# EAGLE design 172x320 Screen (EAGLE 9.6.2)
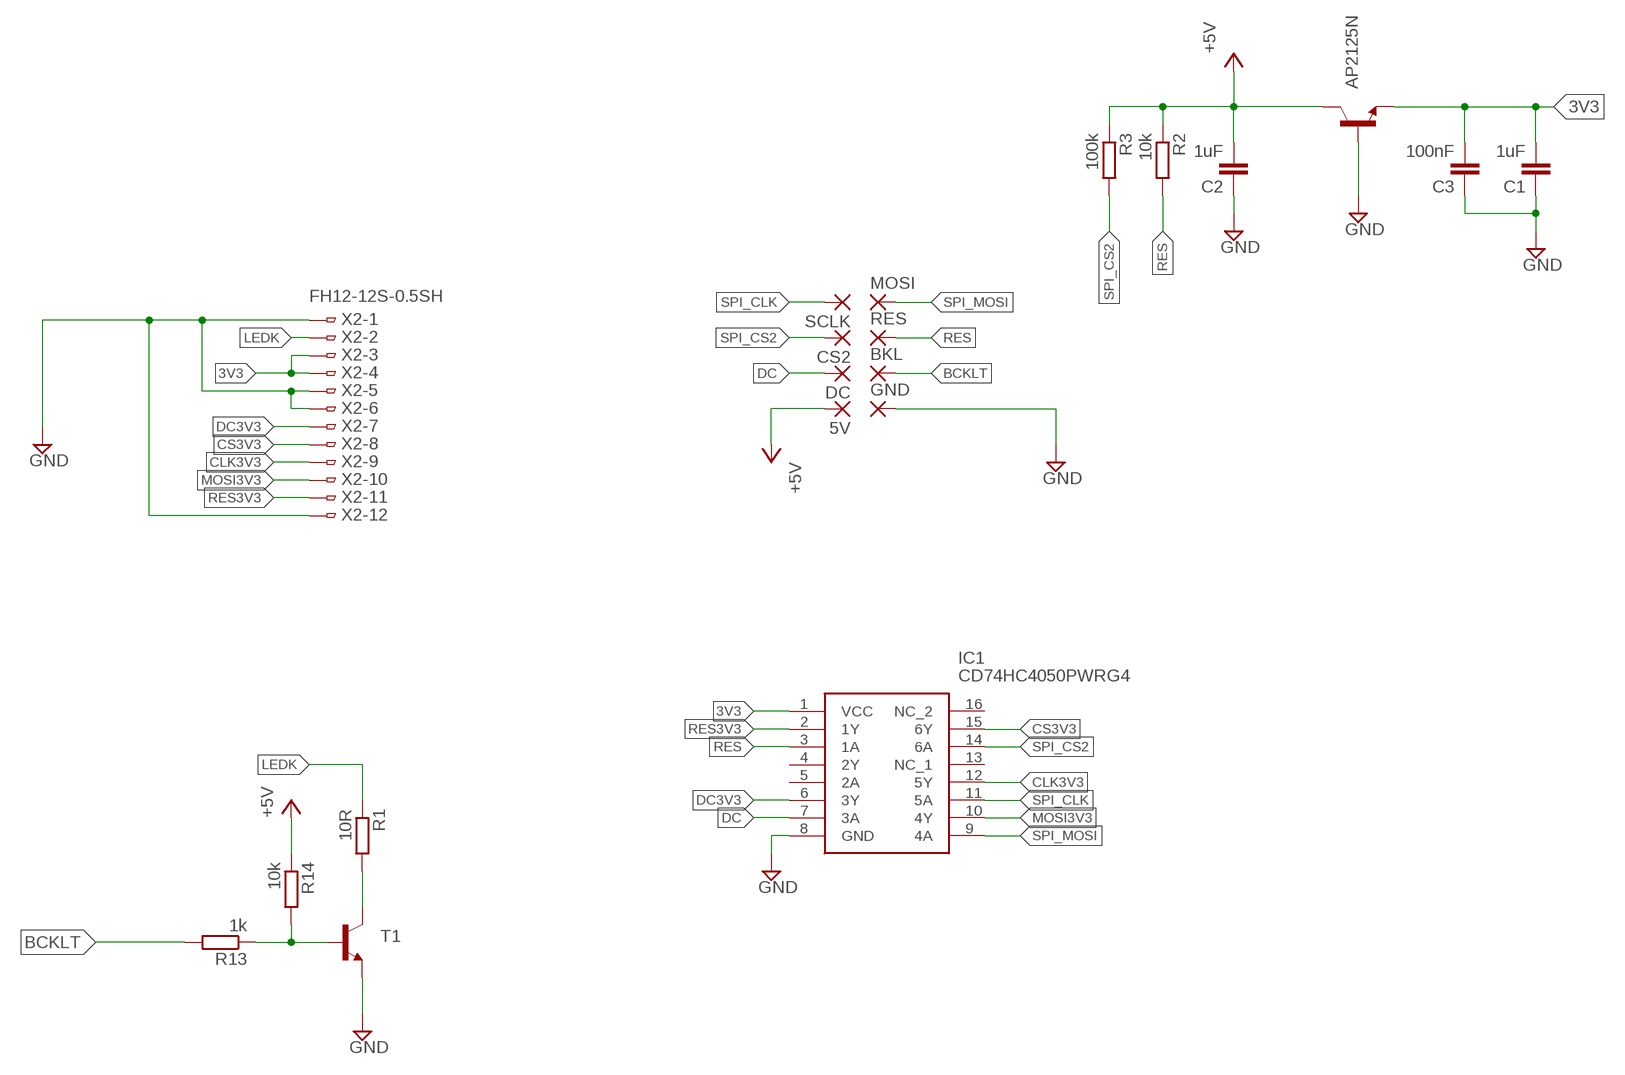
[diagram p0: schematic, sheet 1]

## Parts
5V  1,6/0,9  [1,6/0,9]
AP2125N  BC817-16-NPN-SOT23-BEC  [SOT23-BEC]
BKL  1,6/0,9  [1,6/0,9]
C1  1uF  C-EUC0805  [C0805]
C2  1uF  C-EUC0805  [C0805]
C3  100nF  C-EUC0805  [C0805]
CS2  1,6/0,9  [1,6/0,9]
DC  1,6/0,9  [1,6/0,9]
GND  1,6/0,9  [1,6/0,9]
IC1  CD74HC4050PWRG4  [SOP65P640X120-16N]
MOSI  1,6/0,9  [1,6/0,9]
R1  10R  R-EU_R0805  [R0805]
R2  10k  R-EU_R0805  [R0805]
R3  100k  R-EU_R0805  [R0805]
R13  1k  R-EU_R0805  [R0805]
R14  10k  R-EU_R0805  [R0805]
RES  1,6/0,9  [1,6/0,9]
SCLK  1,6/0,9  [1,6/0,9]
T1  BC817-16-NPN-SOT23-BEC  [SOT23-BEC]
X2  FH12-12S-0.5SH  [FH12-12S-0.5SH]

## Nets
3V3: AP2125N.E C1.2 C3.2 IC1.1(VCC) X2.3 X2.4
+5V: 5V.1(P) AP2125N.C C2.2 R2.1 R3.1 R14.1
BCKLT: BKL.1(P) R13.2
CLK3V3: IC1.12(5Y) X2.9
CS3V3: IC1.15(6Y) X2.8
DC: DC.1(P) IC1.7(3A)
DC3V3: IC1.6(3Y) X2.7
GND: AP2125N.B C1.1 C2.1 C3.1 GND.1(P) IC1.8(GND) T1.E X2.1 X2.5 X2.6 X2.12
LEDK: R1.1 X2.2
MOSI3V3: IC1.10(4Y) X2.10
N$1: R1.2 T1.C
N$16: R13.1 R14.2 T1.B
RES: IC1.3(1A) R2.2 RES.1(P)
RES3V3: IC1.2(1Y) X2.11
SPI_CLK: IC1.11(5A) SCLK.1(P)
SPI_CS2: CS2.1(P) IC1.14(6A) R3.2
SPI_MOSI: IC1.9(4A) MOSI.1(P)
Unconnected: IC1.4(2Y) IC1.5(2A) IC1.13(NC_1) IC1.16(NC_2)

## Library data of the parts
5V BKL CS2 DC GND MOSI RES SCLK = wirepad:1,6/0,9: THROUGH-HOLE PAD
AP2125N T1 = transistor:*-NPN-: NPN Transistror BF959 corrected 2008.03.06
C1-C3 = rcl:C-EU: CAPACITOR, European symbol; SPICEPREFIX: C
IC1 = CD74HC4050PWRG4:CD74HC4050PWRG4: Buffer/Converter 6-CH Non-Inverting CMOS 16-Pin TSSOP T/R Source: Datasheet <https://datasheet.datasheetarchive.com/originals/distributors/Datasheets-SFU2/DSASFU100028959.pdf>; DESCRIPTION: Buffer/Converter 6-CH Non-Inverting CMOS 16-Pin TSSOP T/R; HEIGHT: 1.2mm; MANUFACTURER_NAME: Texas Instruments; MANUFACTURER_PART_NUMBER: CD74HC4050PWRG4; MOUSER_PART_NUMBER: 595-CD74HC4050PWRG4; MOUSER_PRICE-STOCK: https://www.mouser.co.uk/ProductDetail/Texas-Instruments/CD74HC4050PWRG4?qs=xFfolx0DHx2sDiVseCJ27Q%3D%3D
R1-R3 R13 R14 = rcl:R-EU_: RESISTOR, European symbol; SPICEPREFIX: R
X2 = con-hirose-0712:FH12-12S-0.5S: 0.5mm Pitch Connectors For FPC/FFC Source: Data sheet <http://www.hirose.co.jp/cataloge_hp/e58605370.pdf>; MPN: FH12-12S-0.5SH(55); OC_FARNELL: 1324542; OC_NEWARK: 34M6155

## Board
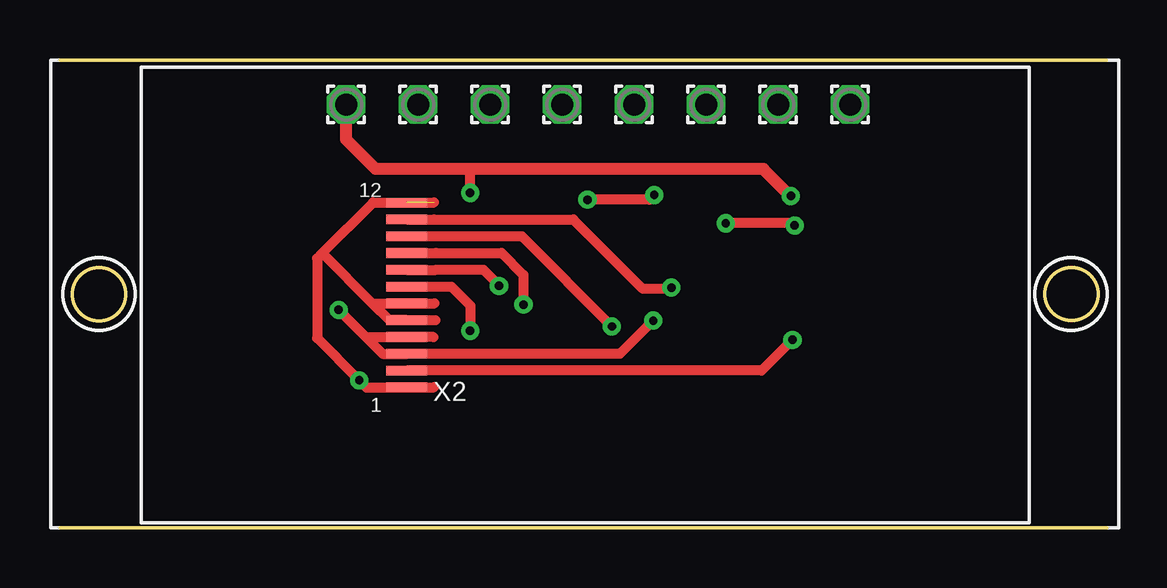
[diagram p1: board, top side]
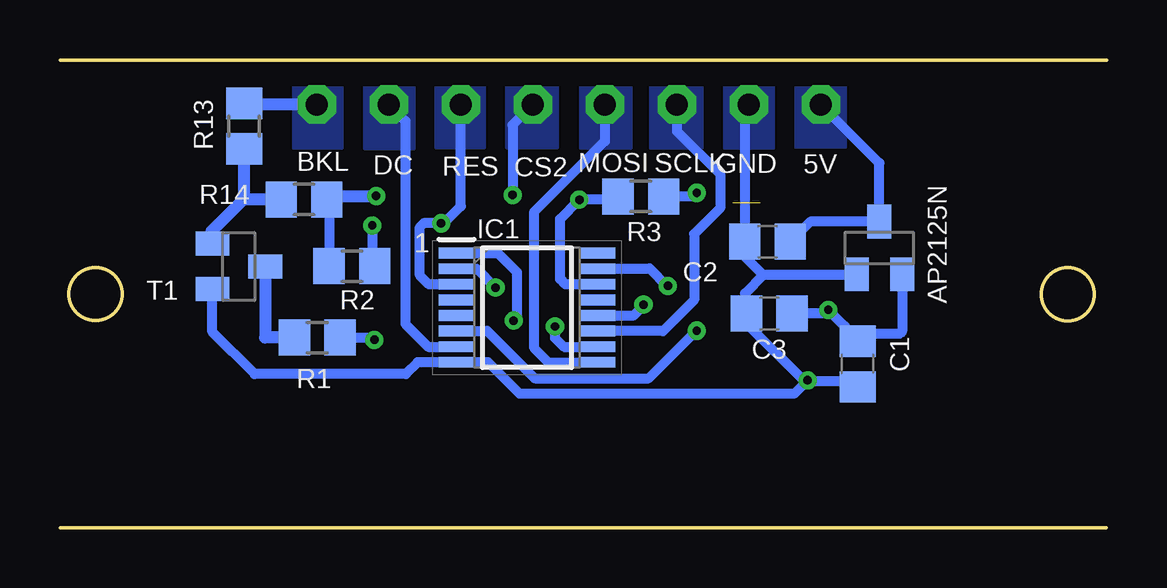
[diagram p2: board, bottom side, seen from below]

Size 43.62 x 19.52 mm. Coordinates in mm from the lower left corner, seen from the top.
Outline: 0,19.52 43.6,19.51
Outline: 43.62,0 0.02,0.01
Outline: circle at 1.63,9.75 radius 1.1
Outline: circle at 42.14,9.76 radius 1.1
Copper layers (1*16): Top 0.035mm / dielectric 1.5mm / Bottom 0.035mm
Design rules "default *": minimum track width 6mil, minimum drill 0.35mm, track to track 6mil, track to pad 6mil, pad to pad 6mil, via to via 6mil, smd to smd 6mil, copper to edge 40mil, drill to drill 6mil, minimum pad ring 3mil, minimum via ring 8mil, stop-mask expansion 4mil, vias tented up to drill 0mil, thermal gap 10mil

### Footprints (pad centres in the part's own frame; a part is rotated, then mirrored left to right if it is on the bottom)
1,6/0,9 = drill 0.914 pad 1.6 octagon: 1 0,0
SOT23-BEC = smd 1 x 1.4: B -0.95,-1.1; C 0,1.1; E 0.95,-1.1
C0805 = smd 1.3 x 1.5: 1 -0.95,0; 2 0.95,0
SOP65P640X120-16N = smd 1.475 x 0.45: 1 -2.938,2.275; 2 -2.938,1.625; 3 -2.938,0.975; 4 -2.938,0.325; 5 -2.938,-0.325; 6 -2.938,-0.975; 7 -2.938,-1.625; 8 -2.938,-2.275; 9 2.938,-2.275; 10 2.938,-1.625; 11 2.938,-0.975; 12 2.938,-0.325; 13 2.938,0.325; 14 2.938,0.975; 15 2.938,1.625; 16 2.938,2.275
R0805 = smd 1.3 x 1.5: 1 -0.95,0; 2 0.95,0
FH12-12S-0.5SH = smd 0.4 x 1.7: 1 -2.75,3.25; 2 -2.05,3.25; 3 -1.35,3.25; 4 -0.65,3.25; 5 0.05,3.25; 6 0.75,3.25; 7 1.45,3.25; 8 2.15,3.25; 9 2.85,3.25; 10 3.55,3.25; 11 4.25,3.25; 12 4.95,3.25

### Placement (x,y rotation side)
5V  11.92,17.66 0 top
AP2125N  9.48,11.68 0 bottom
BKL  32.92,17.66 0 top
C1  10.39,6.84 90 bottom
C2  14.14,11.94 0 bottom
C3  14.07,8.95 0 bottom
CS2  23.92,17.66 0 top
DC  29.92,17.66 0 top
GND  14.92,17.66 0 top
IC1  24.16,9.19 0 bottom
MOSI  20.92,17.66 0 top
R1  32.9,7.94 180 bottom
R2  31.46,10.92 0 bottom
R3  19.42,13.83 180 bottom
R13  35.95,16.76 90 bottom
R14  33.45,13.7 180 bottom
RES  26.92,17.66 0 top
SCLK  17.92,17.66 0 top
T1  36.17,10.91 270 bottom
X2  17.7,8.62 90 top

### Tracks (layer width: path | path; a pad name or v marks a point on that pad's centre or on a via)
3V3  (via drill 0.35)
  Top 0.406: v11.61,9.1 12.74,7.97 | 12.74,7.97 X2.4 15.57,7.96 | 12.74,7.97 13.44,7.27 X2.3 14.47,7.27 14.48,7.26 23.33,7.26 v24.72,8.65
  Bottom 0.406: IC1.1 25.38,11.46 24.58,10.67 24.58,8.8 v24.72,8.66 v24.72,8.65 | C3.2 11.76,8.95 v11.61,9.1 10.92,8.41 10.92,7.84 10.87,7.79 C1.2 10.08,8.1 8.64,8.1 8.53,8.21 AP2125N.E
+5V  (via drill 0.35)
  Top 0.406: v17.08,13.97 v17.09,13.98 17.09,14.97
  Top 0.508: v30.45,13.85 30.43,13.85 29.31,14.97 17.09,14.97 13.15,14.97 11.92,16.2 5V.1
  Bottom 0.406: 5V.1 9.48,15.22 AP2125N.C 12.35,12.78 C2.2 | R14.1 32.41,13.61 R2.1 | R3.1 18.45,13.85 17.22,13.85 v17.09,13.98
  Bottom 0.508: R14.1 32.35,13.85 v30.45,13.85
  pour Bottom (no thermals): 10.9,19.31 10.9,15.88 12.92,15.88 12.94,15.86 12.94,19.31
BCKLT
  Bottom 0.508: BKL.1 35.9,17.66 R13.2
  pour Bottom (no thermals): 31.88,18.66 31.88,15.84 33.89,15.84 33.89,18.66
CLK3V3  (via drill 0.35)
  Top 0.406: 15.66,11.47 X2.9 18.4,11.47 19.31,10.56 v19.31,9.32
  Bottom 0.406: v19.31,9.32 19.31,9.27 19.71,8.87 IC1.12
CS3V3  (via drill 0.35)
  Top 0.406: X2.8 15.66,10.77 | 15.66,10.77 15.67,10.78 | v18.29,10.1 18.29,10.13 17.65,10.77 15.66,10.77
  Bottom 0.406: v18.29,10.1 18.33,10.1 19.05,10.82 21.22,10.82 IC1.15
DC
  Bottom 0.406: IC1.7 28.28,7.56 29.23,8.51 29.23,16.97 DC.1
  pour Bottom (no thermals): 28.88,18.65 28.88,15.83 30.93,15.83 30.93,18.65
DC3V3  (via drill 0.35)
  Top 0.406: X2.7 16.31,10.07 17.1,9.28 v17.1,8.24 v17.09,8.23 | 15.56,10.06 15.55,10.07
  Bottom 0.406: IC1.6 25.82,8.22 23.84,6.24 19.09,6.24 v17.1,8.23 v17.09,8.23
GND  (via drill 0.35)  (1 unrouted)
  Top 0.406: 15.59,13.58 13.05,13.58 10.93,11.46 | 10.93,11.46 10.71,11.24 10.71,7.92 v12.47,6.16 12.77,5.86 X2.1 15.59,5.87 | 10.93,11.46 13.02,9.37 | 15.61,9.37 X2.6 13.02,9.37 | 15.64,8.67 X2.5 13.72,8.67 13.02,9.37
  Bottom 0.406: 37.21,9.9 T1.E 37.27,8.18 35.51,6.42 29.21,6.42 28.71,6.92 IC1.8 25.79,6.92 24.47,5.6 13.03,5.6 12.55,6.08 | GND.1 15.09,17.49 C2.1 15.39,11.64 15.4,11.64 14.34,10.58 | 10.4,10.55 AP2125N.B 14.34,10.58 | C1.1 10.39,6.13 12.44,6.13 v12.47,6.16 12.55,6.08 | 14.34,10.58 14.31,10.55 15.07,9.79 15.07,9 C3.1 15.02,8.54 12.55,6.08
  pour Bottom (no thermals): 13.9,18.66 13.9,15.84 15.92,15.84 15.92,18.66
LEDK  (via drill 0.35)
  Top 0.406: X2.2 29.23,6.57 v30.51,7.85 v30.52,7.85
  Bottom 0.406: R1.1 30.6,7.94 v30.52,7.86 v30.52,7.85
MOSI3V3  (via drill 0.35)
  Top 0.406: 15.58,12.17 X2.10 19.24,12.17 23,8.41 v23,8.4
  Bottom 0.406: IC1.10 22.63,7.56 23,7.93 v23,8.4
N$1
  Bottom 0.508: T1.C 35.07,7.94 R1.2
N$16
  Bottom 0.508: T1.B 37.3,11.89 37.3,12.38 35.95,13.73 R13.1 35.95,13.7 R14.2
RES  (via drill 0.35)
  Top 0.406: v30.61,12.62 30.52,12.71 v27.74,12.71
  Bottom 0.406: RES.1 26.92,13.42 27.63,12.71 v27.74,12.71 28.47,12.71 28.63,12.55 28.63,10.54 28.26,10.16 IC1.3 | v30.61,12.62 30.61,11.02 R2.2
  pour Bottom (no thermals): 25.95,18.61 25.95,15.87 27.94,15.87 27.94,18.61
RES3V3  (via drill 0.35)
  Top 0.406: 15.58,12.87 X2.11 21.39,12.87 24.28,9.98 25.42,9.98 v25.47,10.03
  Bottom 0.406: IC1.2 26.26,10.81 v25.47,10.03
SPI_CLK
  Bottom 0.406: SCLK.1 17.92,16.55 16.12,14.75 16.12,13.34 17.2,12.26 17.2,9.51 18.5,8.21 IC1.11
  pour Bottom (no thermals): 16.89,18.62 16.89,15.85 19.01,15.85 19.01,18.62
SPI_CS2  (via drill 0.35)
  Top 0.406: v24.76,13.89 24.56,13.69 v21.98,13.69
  Bottom 0.406: IC1.14 22.57,10.16 22.78,10.38 22.78,12.89 v21.98,13.69 21.96,13.71 20.49,13.71 R3.2 | CS2.1 24.76,16.82 v24.76,13.89
  pour Bottom (no thermals): 22.9,18.63 22.9,15.86 25,15.86 25,18.63
SPI_MOSI
  Bottom 0.406: MOSI.1 20.92,16.13 23.85,13.2 23.85,7.49 23.28,6.92 IC1.9
  pour Bottom (no thermals): 19.84,18.63 19.84,15.85 21.92,15.85 21.92,18.63

### Text on the board
tPlace: 12 | 1
bPlace: 1